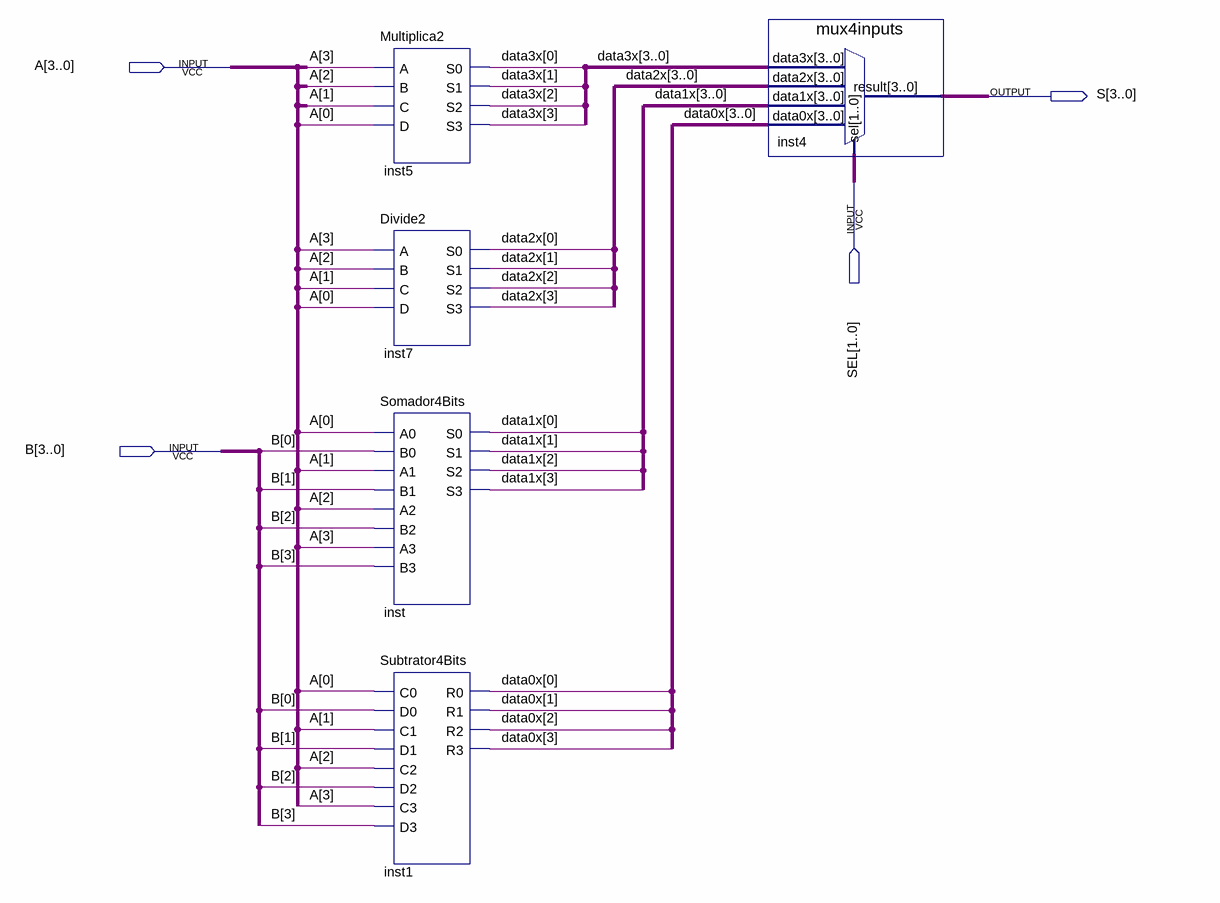
[diagram p0: schematic sheet]
// Quartus schematic ULA.bdf as structural Verilog: 5 symbols, 4 pins
module ULA (
  input  [3:0] A,
  input  [1:0] SEL,
  input  [3:0] B,
  output [3:0] S
);

  wire [3:0] data0x, data1x, data2x, data3x;

  Multiplica2 inst5 (
    .A(A[3]), .B(A[2]), .C(A[1]), .D(A[0]), .S0(data3x[0]), .S1(data3x[1]), .S2(data3x[2]), .S3(data3x[3]));
  Divide2 inst7 (
    .A(A[3]), .B(A[2]), .C(A[1]), .D(A[0]), .S0(data2x[0]), .S1(data2x[1]), .S2(data2x[2]), .S3(data2x[3]));
  Somador4Bits inst (
    .A0(A[0]), .B0(B[0]), .A1(A[1]), .B1(B[1]), .A2(A[2]), .B2(B[2]), .A3(A[3]), .B3(B[3]), .S0(data1x[0]),
    .S1(data1x[1]), .S2(data1x[2]), .S3(data1x[3]));
  Subtrator4Bits inst1 (
    .C0(A[0]), .D0(B[0]), .C1(A[1]), .D1(B[1]), .C2(A[2]), .D2(B[2]), .C3(A[3]), .D3(B[3]), .R0(data0x[0]),
    .R1(data0x[1]), .R2(data0x[2]), .R3(data0x[3]));
  mux4inputs inst4 (.data3x(data3x), .data2x(data2x), .data1x(data1x), .data0x(data0x), .sel(SEL), .result(S));
endmodule
